# Altium schematic sheet sfp_wrapper.SchDoc
size A4
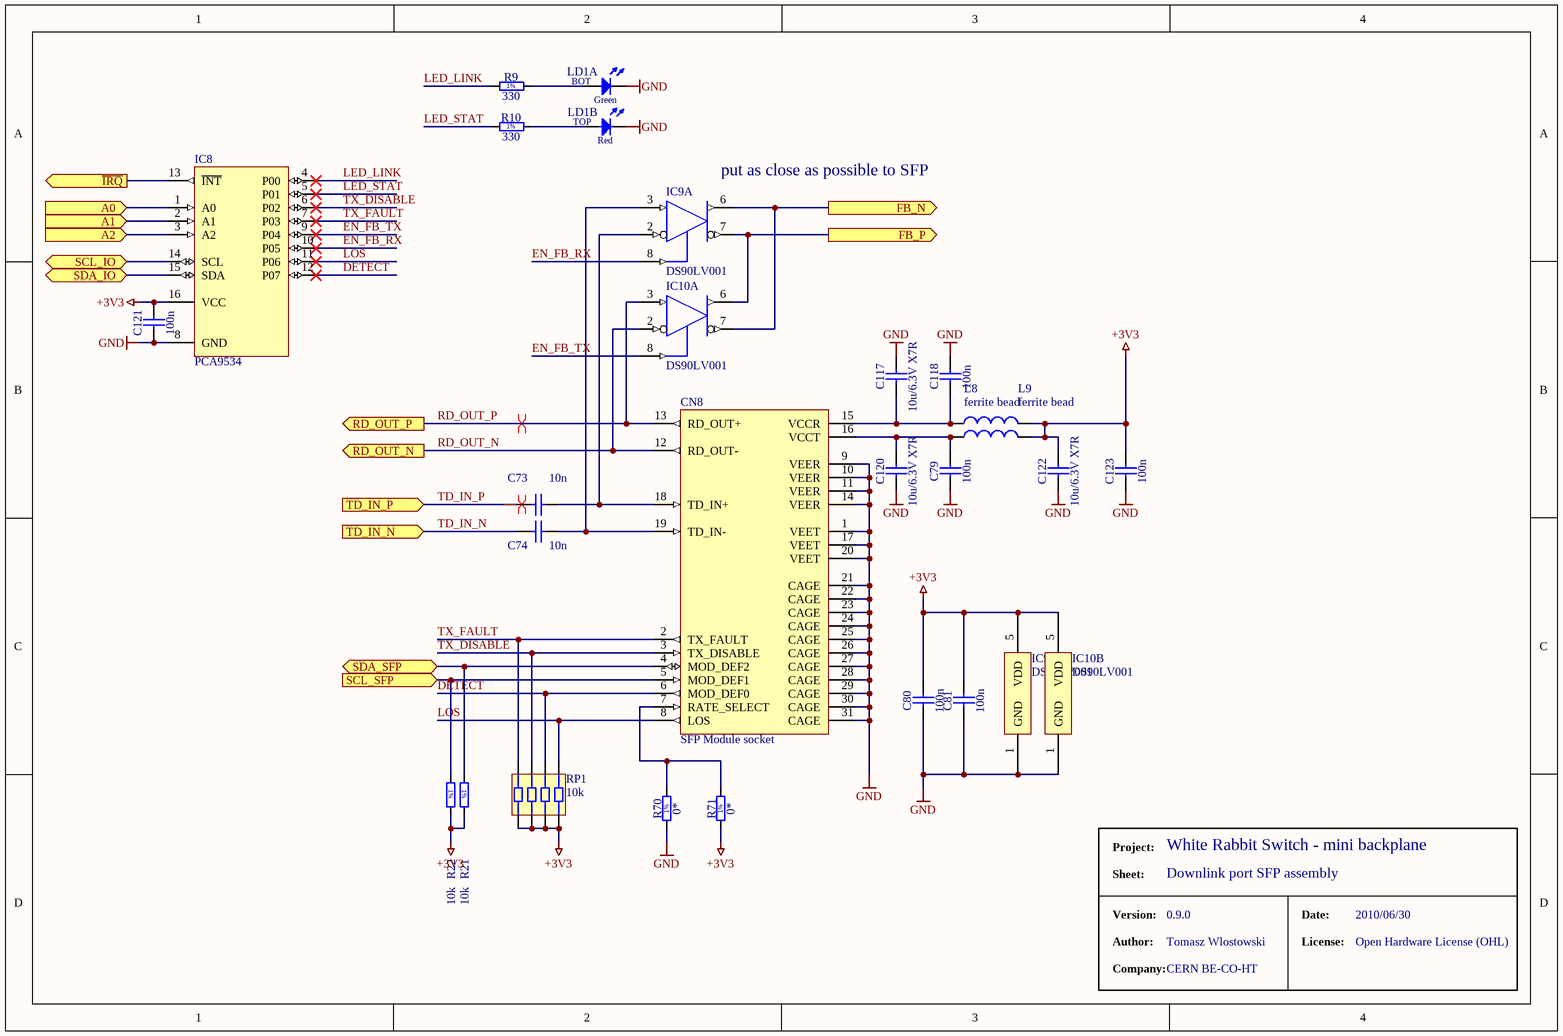
[diagram p0: sfp_wrapper.SchDoc]

## Parts
C73  10n  [CAPC1608X87N]
C74  10n  [CAPC1608X87N]
C79  100n  [CAPC1608X87N]
C80  100n  [CAPC1608X87N]
C81  100n  [CAPC1608X87N]
C117  10u/6.3V X7R  [CAPC3216X140N]
C118  100n  [CAPC1608X87N]
C120  10u/6.3V X7R  [CAPC3216X140N]
C121  100n  [CAPC1608X87N]
C122  10u/6.3V X7R  [CAPC3216X140N]
C123  100n  [CAPC1608X87N]
CN8  SFP Module socket  [SFP_SINGLE_PORT]
IC8  PCA9534  [TSOP65P640-16AM]
IC9  DS90LV001  [SOIC127P600-8AL]  (parts A,B of 2)
IC10  DS90LV001  [SOIC127P600-8AL]  (parts A,B of 2)
L8  value ferrite bead  [INDC2012-0805]  (hidden comment: Inductor)
L9  value ferrite bead  [INDC2012-0805]  (hidden comment: Inductor)
LD1  Red/Green  [LED_DIALIGHT_571-0112-100F]  (value not drawn)  (parts A,B of 2)
R9  330  [RESC1608X55N]
R10  330  [RESC1608X55N]
R21  10k  [RESC1608X55N]
R22  10k  [RESC1608X55N]
R70  0*  [RESC1608X55N]
R71  0*  [RESC1608X55N]
RP1  10k  [CAY-16]

## Ports
A0 (in), A1 (in), A2 (in), FB_N (out), FB_P (out), RD_OUT_N (out), RD_OUT_P (out), SCL_IO (bidir), SCL_SFP (in), SDA_IO (bidir), SDA_SFP (bidir), TD_IN_N (in), TD_IN_P (in), ~{IRQ} (out)

## Nets
+3V3: C80.2 C81.2 C121.2 C122.2 C123.2 IC8.16(VCC) IC9.5(VDD) IC10.5(VDD) L8.2 L9.2 R21.2 R22.2 R71.1 RP1.1 RP1.2 RP1.3 RP1.4
GND: C79.1 C80.1 C81.1 C117.2 C118.2 C120.1 C121.1 C122.1 C123.1 CN8.1(VEET) CN8.9(VEER) CN8.10(VEER) CN8.11(VEER) CN8.14(VEER) CN8.17(VEET) CN8.20(VEET) CN8.21(CAGE) CN8.22(CAGE) CN8.23(CAGE) CN8.24(CAGE) CN8.25(CAGE) CN8.26(CAGE) CN8.27(CAGE) CN8.28(CAGE) CN8.29(CAGE) CN8.30(CAGE) CN8.31(CAGE) IC8.8(GND) IC9.1(GND) IC10.1(GND) LD1.1(C) LD1.3(C) R70.1
A0: IC8.1(A0) ; port A0
A1: IC8.2(A1) ; port A1
A2: IC8.3(A2) ; port A2
DETECT: CN8.6(MOD_DEF0) IC8.12(P07) RP1.6
EN_FB_RX: IC8.10(P05) IC9.8(EN)
EN_FB_TX: IC8.9(P04) IC10.8(EN)
FB_N: IC9.6(OUT+) IC10.7(OUT-) ; port FB_N
FB_P: IC9.7(OUT-) IC10.6(OUT+) ; port FB_P
~{IRQ}: IC8.13(~{INT}) ; port ~{IRQ}
LED_LINK: IC8.4(P00) R9.1
LED_STAT: IC8.5(P01) R10.1
LOS: CN8.8(LOS) IC8.11(P06) RP1.5
RD_OUT_N: CN8.12(RD_OUT-) IC10.2(IN-) ; port RD_OUT_N
RD_OUT_P: CN8.13(RD_OUT+) IC10.3(IN+) ; port RD_OUT_P
SCL_IO: IC8.14(SCL) ; port SCL_IO
SCL_SFP: CN8.5(MOD_DEF1) R22.1 ; port SCL_SFP
SDA_IO: IC8.15(SDA) ; port SDA_IO
SDA_SFP: CN8.4(MOD_DEF2) R21.1 ; port SDA_SFP
TD_IN_N: C74.1 ; port TD_IN_N
TD_IN_P: C73.1 ; port TD_IN_P
TX_DISABLE: CN8.3(TX_DISABLE) IC8.6(P02) RP1.7
TX_FAULT: CN8.2(TX_FAULT) IC8.7(P03) RP1.8
NetC73_2: C73.2 CN8.18(TD_IN+) IC9.2(IN-)
NetC74_2: C74.2 CN8.19(TD_IN-) IC9.3(IN+)
NetC79_2: C79.2 C120.2 CN8.16(VCCT) L8.1
NetC117_1: C117.1 C118.1 CN8.15(VCCR) L9.1
NetCN8_7: CN8.7(RATE_SELECT) R70.2 R71.2
NetLD1_2: LD1.2(A) R9.2
NetLD1_4: LD1.4(A) R10.2

## Layout directives
differential pair: RD_OUT_P, TD_IN_P

## Notes on the sheet
- (near IC9) put as close as possible to SFP
- Project:
- White Rabbit Switch - mini backplane
- Sheet:
- Version:
- Downlink port SFP assembly
- 0.9.0
- Date:
- 2010/06/30
- Author:
- Company:
- Tomasz Wlostowski
- CERN BE-CO-HT
- License:
- Open Hardware License (OHL)
- (in symbol LED_DIALIGHT_571-0112-100F, part A) BOT; Green
- (in symbol LED_DIALIGHT_571-0112-100F, part B) TOP; Red
- (in symbol R0603_0R_JUMPER) 1%
- (in symbol R0603_10K_1%_0.1W_100PPM) 1%
- (in symbol R0603_330R_1%_0.1W_100PPM) 1%

## Library data of the parts
C73 C74 = CC0603_10NF_50V_10%_X7R: Non-polarised capacitor; Part Description: SMD Multilayer Chip Ceramic Capacitor; Manufacturer: GENERIC; Manufacturer1 Part Number: 223858615636; Value: 10nF; Voltage: 50V; TC: X7R; Tolerance: ±10%; Table: Capacitors SMD; Part Number: CC0603_10NF_50V_10%_X7R; Component Kind: Standard; Component Type: Standard; Pin Count: 2; Status: Preferred; Manufacturer Part Number: CC0603_10NF_50V_10%_X7R; Case: 0603; Mounted: Yes; Socket: No; SMD: Yes; Manufacturer1 Example: PHYCOMP; Manufacturer1 ComponentHeight: 0.87mm; HelpURL: \\cern.ch\dfs\Applications\Altium\Datasheets\CC0603_X7R_PHYCOMP.pdf; Author: CERN DEM JLC; CreateDate: 12/3/2007; LatestRevisionDate: 12/3/2007
C79-C81 C118 C121 C123 = CC0603_100NF_50V_10%_X7R: Non-polarised capacitor; Part Description: SMD Multilayer Chip Ceramic Capacitor; Manufacturer: GENERIC; Manufacturer1 Part Number: 223858615649; Manufacturer1 Datasheet: \\cern.ch\dfs\Applications\Altium\Datasheets\CC0603_X7R_PHYCOMP.pdf; Value: 100nF; Voltage: 50V; TC: X7R; Tolerance: ±10%; Table: Capacitors SMD; Part Number: CC0603_100NF_50V_10%_X7R; Component Kind: Standard; Component Type: Standard; Designator: Capacitor - non polarized; Library Reference: Capacitor - non polarized; Pin Count: 2; Status: Preferred; Manufacturer Part Number: CC0603_100NF_50V_10%_X7R; Case: 0603; Mounted: Yes; Socket: No; SMD: Yes; Manufacturer1 Example: PHYCOMP; Manufacturer1 ComponentHeight: 0.87mm; HelpURL: \\cern.ch\dfs\Applications\Altium\Datasheets\CC0603_X7R_PHYCOMP.pdf; Author: CERN DEM JLC; CreateDate: 12/3/2007; LatestRevisionDate: 12/3/2007
C117 C120 C122 = CC1206_10UF_10V_10%_X7R: Non-polarised capacitor; Part Description: SMD Multilayer Chip Ceramic Capacitor; Manufacturer: GENERIC; Manufacturer1 Part Number: C1206C106K8RAC; Manufacturer1 Datasheet: \\cern.ch\dfs\Applications\Altium\Datasheets\CC1206_X7R_KEMET.pdf; Value: 10uF; Voltage: 10V; Tolerance: ±10%; Table: Capacitors SMD; Part Number: CC1206_10UF_10V_10%_X7R; Component Kind: Standard; Component Type: Standard; Designator: Capacitor - non polarized; Library Reference: Capacitor - non polarized; Pin Count: 2; Status: Preferred; TC: X7R; Manufacturer Part Number: CC1206_10uF_10V_10%_X7R; Case: 1206; Mounted: Yes; Socket: No; SMD: Yes; Manufacturer1 Example: KEMET; Manufacturer1 ComponentHeight: 1.8mm; HelpURL: \\cern.ch\dfs\Applications\Altium\Datasheets\CC1206_X7R_KEMET.pdf; Author: CERN DEM JLC; CreateDate: 12/3/2007; LatestRevisionDate: 12/3/2007
CN8 = SFP_SOCKET_SINGLE: Socket for SFP module; RefId: Far/1256176
IC8 = PCA9534: 8-bit I2C I/O expander; Value: PCA9534PW; Supplier: Farnell
IC9 IC10 = DS90LV001: LVDS buffer with enable
L8 L9 = Inductor: Ferrite bead; Published: 8-Jun-2000; Revision: July-2002: Re-released for DXP Platform.; Publisher: Altium Limited
LD1 = LED_DIALIGHT_571-0112-100F: 2x LED  Botom Green, Top Red; Part Description: Dual 2mm  LEDs, Red Top,Green Bot, CBI® Circuit Board Indicator (With positioning pins); Table: LEDs & Displays; Part Number: LED_DIALIGHT_571-0112-100F; Component Kind: Standard; Component Type: Standard; Color: Red/Green; PackageDescription: 2x 2mm LED (Top: Red, Bot: Green) PCB Edge Mounting (With positioning pins) DIALIGHT 571 Serie; Manufacturer: DIALIGHT; Manufacturer Part Number: 571-0112-100F; Pin Count: 4; Mounted: Yes; Socket: No; SMD: No; ComponentHeight: 8.6mm; HelpURL: \\cern.ch\dfs\Applications\Altium\Datasheets\LED_DIALIGHT_571-0112-100F.pdf; Author: CERN DEM JLC; CreateDate: 11/5/2009; LatestRevisionDate: 3/17/2010
R9 R10 = R0603_330R_1%_0.1W_100PPM: Resistor - 1%; Part Description: General Purpose Thick Film Chip Resistor; Manufacturer: GENERIC; Manufacturer1 Part Number: NRC06F3300TRF; Power: 0.1W; TC: ±100ppm/°C; Table: Resistors SMD; Part Number: R0603_330R_1%_0.1W_100PPM; Component Kind: Standard; Component Type: Standard; Pin Count: 2; Value: 330; Status: Preferred; Tolerance: ±1%; Manufacturer Part Number: R0603_330R_1%_0.1W_100PPM; Case: 0603; Mounted: Yes; Socket: No; SMD: Yes; Manufacturer1 Example: NIC COMPONENT; Manufacturer1 ComponentHeight: 0.55mm; HelpURL: \\cern.ch\dfs\Applications\Altium\Datasheets\R0603_NIC_NRC.pdf; Author: CERN DEM JLC; CreateDate: 12/3/2007; LatestRevisionDate: 3/13/2008
R21 R22 = R0603_10K_1%_0.1W_100PPM: Resistor - 1%; Part Description: General Purpose Thick Film Chip Resistor; Manufacturer: GENERIC; Manufacturer1 Part Number: NRC06F1002TRF; Power: 0.1W; TC: ±100ppm/°C; Table: Resistors SMD; Part Number: R0603_10K_1%_0.1W_100PPM; Component Kind: Standard; Component Type: Standard; Pin Count: 2; Value: 10k; Status: Preferred; Tolerance: ±1%; Manufacturer Part Number: R0603_10K_1%_0.1W_100PPM; Case: 0603; Mounted: Yes; Socket: No; SMD: Yes; Manufacturer1 Example: NIC COMPONENT; Manufacturer1 ComponentHeight: 0.55mm; HelpURL: \\cern.ch\dfs\Applications\Altium\Datasheets\R0603_NIC_NRC.pdf; Author: CERN DEM JLC; CreateDate: 12/3/2007; LatestRevisionDate: 3/13/2008
R70 R71 = R0603_0R_JUMPER: Resistor - 1%; Part Description: 1A (0.05R Max DC Resistance) Zero Ohm Jumper; Manufacturer: GENERIC; Manufacturer1 Part Number: NRC06Z0; Manufacturer1 Datasheet: \\cern.ch\dfs\Applications\Altium\Datasheets\R0603_NIC_NRC.pdf; Value: 0; Table: Resistors SMD; Part Number: R0603_0R_JUMPER; Component Kind: Standard; Component Type: Standard; Designator: Resistor - 1%; Library Reference: Resistor - 1%; Pin Count: 2; Status: Preferred; Manufacturer Part Number: R0603_0R_JUMPER; Case: 0603; Mounted: Yes; Socket: No; SMD: Yes; Manufacturer1 Example: NIC COMPONENT; Manufacturer1 ComponentHeight: 0.55mm; HelpURL: \\cern.ch\dfs\Applications\Altium\Datasheets\R0603_NIC_NRC.pdf; Author: CERN DEM JLC; CreateDate: 12/3/2007; LatestRevisionDate: 3/13/2008
RP1 = RES_ARRAY_1206: Resistor network 1206 (4x0402) Maritex RAC4Xxxx